# Altium schematic sheet Sheet4.SchDoc: Signal Conditioning & ZCD
size 420 x 297 mm; SheetNumber: 4; SheetTotal: 5
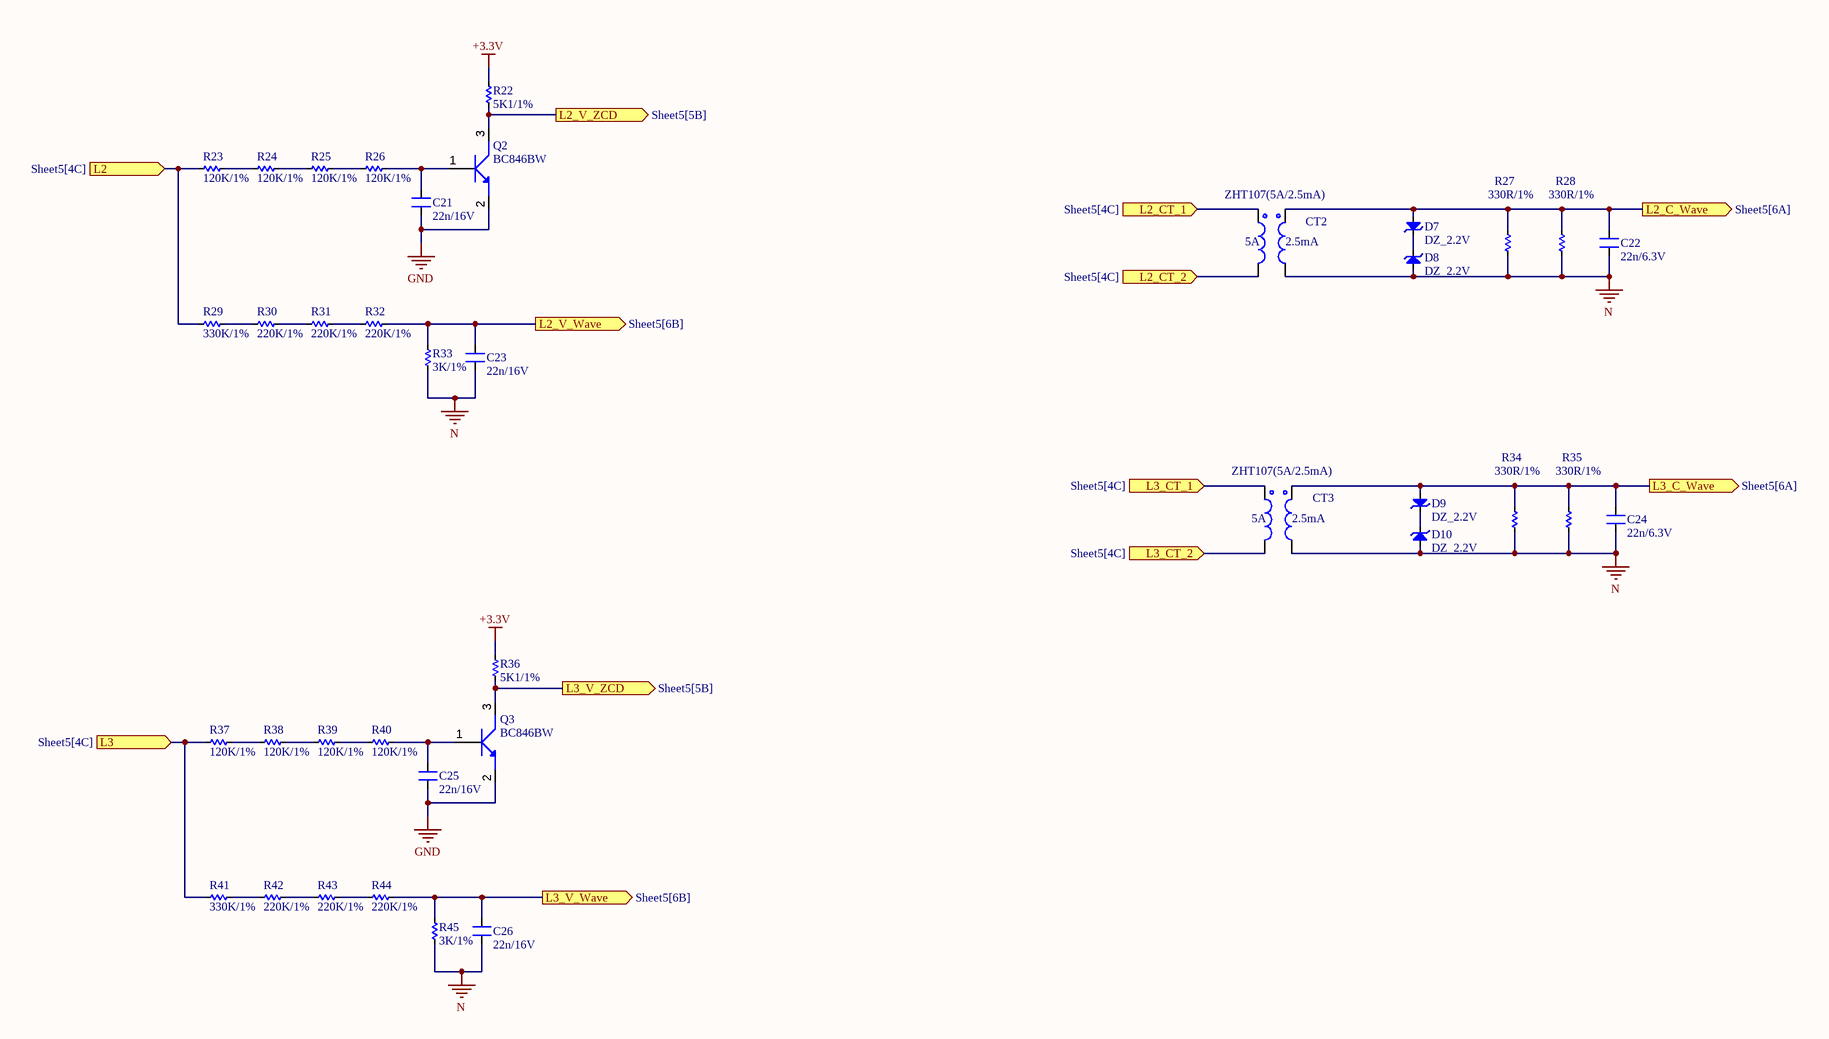
[diagram p0: Sheet4.SchDoc]

## Parts
C21  22n/16V  [CAP_C_2012X110]
C22  22n/6.3V  [CAP_C_2012X110]
C23  22n/16V  [CAP_C_2012X110]
C24  22n/6.3V  [CAP_C_2012X110]
C25  22n/16V  [CAP_C_2012X110]
C26  22n/16V  [CAP_C_2012X110]
CT2  ZHT107(5A/2.5mA)  [ZHT107]
CT3  ZHT107(5A/2.5mA)  [ZHT107]
D7  DZ_2.2V  [LL-34]
D8  DZ_2.2V  [LL-34]
D9  DZ_2.2V  [LL-34]
D10  DZ_2.2V  [LL-34]
Q2  BC846BW  [SOT-323]
Q3  BC846BW  [SOT-323]
R22  5K1/1%  [RES_C_2012X65]
R23  120K/1%  [RES_C_3216X70]
R24  120K/1%  [RES_C_3216X70]
R25  120K/1%  [RES_C_3216X70]
R26  120K/1%  [RES_C_3216X70]
R27  330R/1%  [RES_C_3216X70]
R28  330R/1%  [RES_C_3216X70]
R29  330K/1%  [RES_C_3216X70]
R30  220K/1%  [RES_C_3216X70]
R31  220K/1%  [RES_C_3216X70]
R32  220K/1%  [RES_C_3216X70]
R33  3K/1%  [RES_C_2012X65]
R34  330R/1%  [RES_C_3216X70]
R35  330R/1%  [RES_C_3216X70]
R36  5K1/1%  [RES_C_2012X65]
R37  120K/1%  [RES_C_3216X70]
R38  120K/1%  [RES_C_3216X70]
R39  120K/1%  [RES_C_3216X70]
R40  120K/1%  [RES_C_3216X70]
R41  330K/1%  [RES_C_3216X70]
R42  220K/1%  [RES_C_3216X70]
R43  220K/1%  [RES_C_3216X70]
R44  220K/1%  [RES_C_3216X70]
R45  3K/1%  [RES_C_2012X65]

## Ports
L2 (in, see Sheet5[4C]), L2_C_Wave (out, see Sheet5[6A]), L2_CT_1 (in, see Sheet5[4C]), L2_CT_2 (in, see Sheet5[4C]), L2_V_Wave (out, see Sheet5[6B]), L2_V_ZCD (out, see Sheet5[5B]), L3 (in, see Sheet5[4C]), L3_C_Wave (out, see Sheet5[6A]), L3_CT_1 (in, see Sheet5[4C]), L3_CT_2 (in, see Sheet5[4C]), L3_V_Wave (out, see Sheet5[6B]), L3_V_ZCD (out, see Sheet5[5B])

## Nets
+3.3V: R22.1 R36.1
GND: C21.1 C25.1 Q2.2(E) Q3.2(E)
N: C22.1 C23.1 C24.1 C26.1 CT2.4 CT3.4 D8.2(A) D10.2(A) R27.2 R28.2 R33.2 R34.2 R35.2 R45.2
L2: R23.2 R29.2 ; port L2
L2_C_Wave: C22.2 CT2.3 D7.2(A) R27.1 R28.1 ; port L2_C_Wave
L2_CT_1: CT2.1 ; port L2_CT_1
L2_CT_2: CT2.2 ; port L2_CT_2
L2_V_Wave: C23.2 R32.1 R33.1 ; port L2_V_Wave
L2_V_ZCD: Q2.3(C) R22.2 ; port L2_V_ZCD
L3: R37.2 R41.2 ; port L3
L3_C_Wave: C24.2 CT3.3 D9.2(A) R34.1 R35.1 ; port L3_C_Wave
L3_CT_1: CT3.1 ; port L3_CT_1
L3_CT_2: CT3.2 ; port L3_CT_2
L3_V_Wave: C26.2 R44.1 R45.1 ; port L3_V_Wave
L3_V_ZCD: Q3.3(C) R36.2 ; port L3_V_ZCD
NetC21_2: C21.2 Q2.1(B) R26.1
NetC25_2: C25.2 Q3.1(B) R40.1
NetD7_1: D7.1(K) D8.1(K)
NetD9_1: D9.1(K) D10.1(K)
NetR23_1: R23.1 R24.2
NetR24_1: R24.1 R25.2
NetR25_1: R25.1 R26.2
NetR29_1: R29.1 R30.2
NetR30_1: R30.1 R31.2
NetR31_1: R31.1 R32.2
NetR37_1: R37.1 R38.2
NetR38_1: R38.1 R39.2
NetR39_1: R39.1 R40.2
NetR41_1: R41.1 R42.2
NetR42_1: R42.1 R43.2
NetR43_1: R43.1 R44.2

## Notes on the sheet
- Sub-system:
- Project:
- Design by:
- Sheet title:
- Sheet
- of
- Checked by:
- Approved by:
- Doc No:
- Revision:
- Size:
- Date:
- A3
- (in symbol ZHT-107) 5A; 2.5mA

## Library data of the parts
C21-C26 = CAP_SMD
CT2 CT3 = ZHT-107: C5183046
D7-D10 = DIODE Zener: Zenner
Q2 Q3 = BJT_NPN: LCSC Part #: *
R22-R45 = Res-SMD: Resistor; Manufacturer: Generic Components; Class: Passive; Published: 08/06/2000; Publisher: Altium Hobart Technology Centre
  R22 R36: LCSC Part #: C26023
  R23-R26 R37-R40: LCSC Part #: C17908
  R27 R28 R34 R35: LCSC Part #: C912714
  R29 R41: LCSC Part #: C17929
  R30-R32 R42-R44: LCSC Part #: C17956
  R33 R45: LCSC Part #: C212458